# Altium schematic sheet NMT_SPEAKER_PWM.SCHDOC
size A4; Organization: Altium Limited; Address1: L3, 12a Rodborough Rd; Address2: Frenchs Forest; Address3: NSW; Address4: Australia 2086; DocumentNumber: 8; SheetNumber: 6; SheetTotal: 13
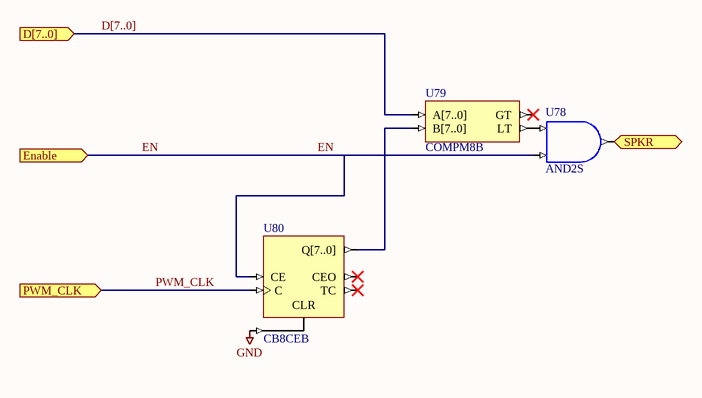
[diagram p0: NMT_SPEAKER_PWM.SCHDOC]

## Parts
U78  AND2S
U79  COMPM8B
U80  CB8CEB

## Ports
D[7..0] (in), Enable (in), PWM_CLK (in), SPKR (out)

## Nets
GND: U80.CLR
D[7..0]: U79.A[7..0] ; port D[7..0]
EN: U78.I1 U80.CE ; port Enable
PWM_CLK: U80.C ; port PWM_CLK
SPKR: U78.O ; port SPKR
NetU78_I0: U78.I0 U79.LT
NetU79_B[7..0]: U79.B[7..0] U80.Q[7..0]

Not connected (* = marked no-connect by the designer): U79 GT*; U80 CEO* TC*

## Buses and harness runs
bus D[7..0] = port D[7..0]

## Notes on the sheet
- Title
- Size:
- Date:
- A4
- Number:
- Time:
- Revision:
- Sheet
- of
- File:

## Library data of the parts
U78 = AND2S: 2-Input AND Gate, Single Pin Version; Xilinx Equivalent: AND2; ArchiveName: GENERIC; Published: 7-Nov-2003; Publisher: Altium Limited; Core Revision: 1.00.00
U79 = COMPM8B: 8-Bit Magnitude Comparator, Bus Version; Xilinx Equivalent: COMPM8; ArchiveName: GENERIC; Published: 7-Nov-2003; Publisher: Altium Limited; Core Revision: 1.00.00
U80 = CB8CEB: 8-Bit Cascadable Binary Counters with Clock Enable and Asynchronous Clear, Bus Version; Xilinx Equivalent: CB8CE; ArchiveName: GENERIC; Published: 7-Nov-2003; Publisher: Altium Limited; Core Revision: 1.00.00